# Altium schematic sheet AS5600_AS5601.SchDoc: AS5600(S)/AS5601 Dev. Board
size A4 portrait; DrawnBy: Sklyar Roman; Organization: S-LAB; Address1: Russian Federation; Address2: Sergiev Posad; DocumentNumber: 1; Revision: 1.1; SheetNumber: 1; SheetTotal: 1
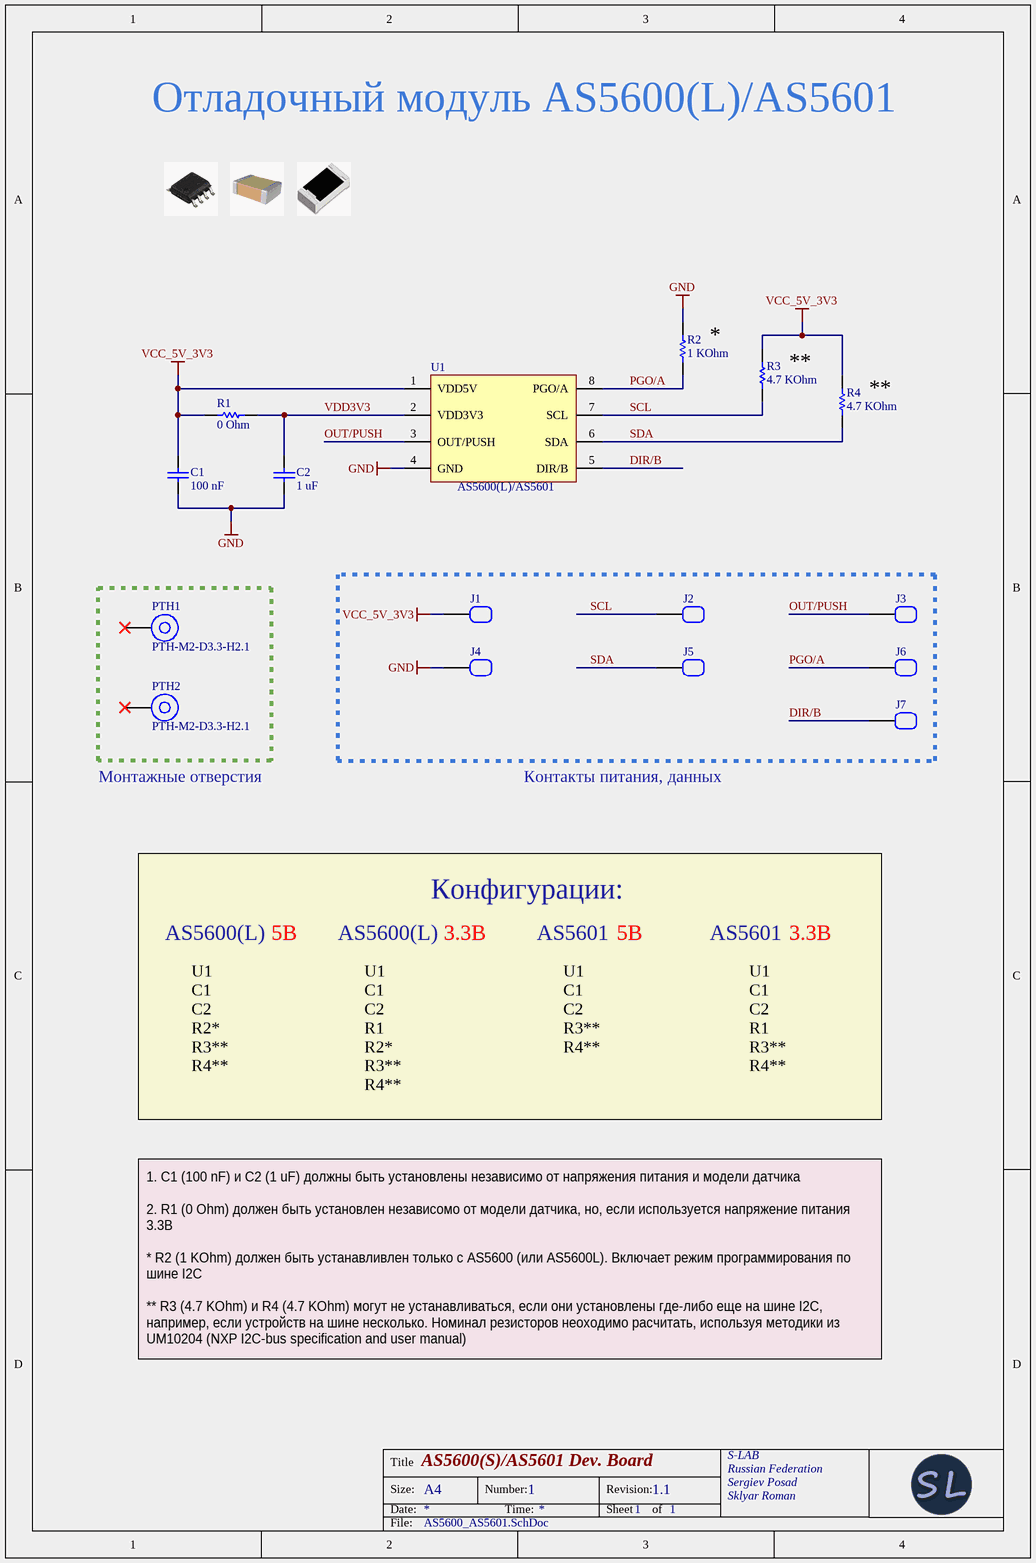
[diagram p0: AS5600_AS5601.SchDoc]

## Parts
C1  Capacitance: 100 nF  [CAPC0603]  (hidden comment: CAP-100N)
C2  Capacitance: 1 uF  [CAPC0603]  (hidden comment: CAP-1U)
J1  Pad  [P_RR-1mm-2.5mm-50%]  (value not drawn)  (no BOM)
J2  Pad  [P_RR-1mm-2.5mm-50%]  (value not drawn)  (no BOM)
J3  Pad  [P_RR-1mm-2.5mm-50%]  (value not drawn)  (no BOM)
J4  Pad  [P_RR-1mm-2.5mm-50%]  (value not drawn)  (no BOM)
J5  Pad  [P_RR-1mm-2.5mm-50%]  (value not drawn)  (no BOM)
J6  Pad  [P_RR-1mm-2.5mm-50%]  (value not drawn)  (no BOM)
J7  Pad  [P_RR-1mm-2.5mm-50%]  (value not drawn)  (no BOM)
PTH1  PTH-M2-D3.3-H2.1  [PTH-M2-D4-H2.1]  (no BOM)
PTH2  PTH-M2-D3.3-H2.1  [PTH-M2-D4-H2.1]  (no BOM)
R1  Resistance: 0 Ohm  [RES0603]  (hidden comment: RES-0)
R2  Resistance: 1 KOhm  [RES0603]  (hidden comment: RES-1K)
R3  Resistance: 4.7 KOhm  [RES0603]  (hidden comment: RES-4K7)
R4  Resistance: 4.7 KOhm  [RES0603]  (hidden comment: RES-4K7)
U1  AS5600(L)/AS5601  [SOIC-8-150]

## Nets
GND: C1.1 C2.1 J4.1 R2.2 U1.4(GND)
VCC_5V_3V3: C1.2 J1.1 R1.2 R3.2 R4.2 U1.1(VDD5V)
DIR/B: J7.1 U1.5(DIR/B)
OUT/PUSH: J3.1 U1.3(OUT/PUSH)
PGO/A: J6.1 R2.1 U1.8(PGO/A)
SCL: J2.1 R3.1 U1.7(SCL)
SDA: J5.1 R4.1 U1.6(SDA)
VDD3V3: C2.2 R1.1 U1.2(VDD3V3)

Not connected (* = marked no-connect by the designer): PTH1 PTH*; PTH2 PTH*

## Notes on the sheet
- Отладочный модуль AS5600(L)/AS5601
- (near R2) *
- **
- (near R4) **
- Монтажные отверстия
- Контакты питания, данных
- Конфигурации:
- AS5600(L)
- 5В
- 3.3В
- AS5601
- U1
  C1
  C2
  R2*
  R3**
  R4**
- U1
  C1
  C2
  R1
  R2*
  R3**
  R4**
- U1
  C1
  C2
  R3**
  R4**
- U1
  C1
  C2
  R1
  R3**
  R4**
- 1. C1 (100 nF) и C2 (1 uF) должны быть установлены независимо от напряжения питания и модели датчика
  2. R1 (0 Ohm) должен быть установлен независомо от модели датчика, но, если используется напряжение питания 3.3В
  * R2 (1 KOhm) должен быть устанавливлен только с AS5600 (или AS5600L). Включает режим программирования по шине I2C
  ** R3 (4.7 KOhm) и R4 (4.7 KOhm) могут не устанавливаться, если они установлены где-либо еще на шине I2C, например, если устройств на шине несколько. Номинал резисторов неоходимо расчитать, используя методики из UM10204 (NXP I2C-bus specification and user manual)
- Title
- Size:
- Date:
- A4
- Number:
- Time:
- Revision:
- Sheet
- of
- File:

## Library data of the parts
C1 = CAP-100N: Chip Capacitor, 100 nF, +/- 5%; Voltage Rating: 50 V; Mount: Surface Mount; Tolerance: 5 %; Type: Capacitor
C2 = CAP-1U: Chip Capacitor, 1 uF, +/- 5%; Voltage Rating: 50 V; Mount: Surface Mount; Tolerance: 5 %; Type: Capacitor
PTH1 PTH2 = PTH-M2-D4-H2.1
R1 = RES-0: Chip Resistor, 0 Ohm, +/- 1%; Voltage Rating: 50 V; Mount: Surface Mount; Tolerance: 1 %; Type: Resistor
R2 = RES-1K: Chip Resistor, 1 KOhm, +/- 1%; Voltage Rating: 50 V; Mount: Surface Mount; Tolerance: 1 %; Type: Resistor
R3 R4 = RES-4K7: Chip Resistor, 4.7 KOhm, +/- 1%; Voltage Rating: 50 V; Mount: Surface Mount; Tolerance: 1 %; Type: Resistor
U1 = AS5600: 12-bit on-axis magnetic rotary position sensor with analog or PWM output; Type: Position Sensor; Mount: Surface Mount; PartNumber: AS5600